# EAGLE design miniSpinac (EAGLE 6.4)
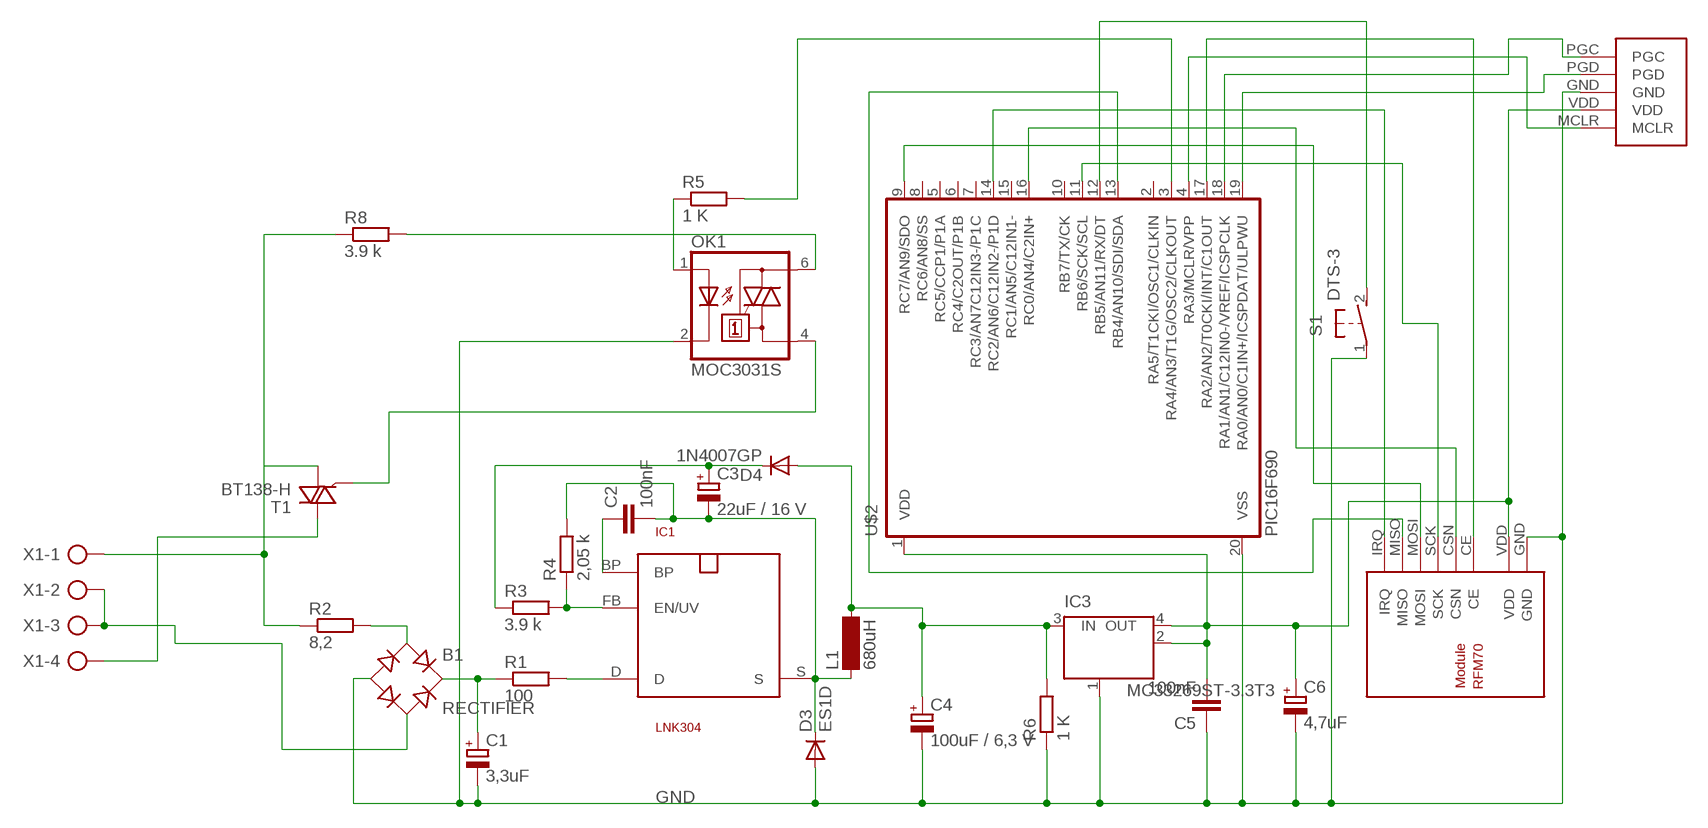
[diagram p0: schematic, sheet 1]

## Parts
B1  RECTIFIER  RECTIFIER-S40  [TO-269AA]
C1  3,3uF  CPOL-EUE5-10.5  [E5-10,5]
C2  100nF  C-EUC2012  [C2012]
C3  22uF / 16 V  CPOL-EUSMCC  [SMC_C]
C4  100uF / 6,3 V  CPOL-EUE2.5-5  [E2,5-5]
C5  100nF  C-EUC2012  [C2012]
C6  4,7uF  CPOL-EUSMCA  [SMC_A]
D3  ES1D  DIODE-DO214AC  [DO214AC]
D4  1N4007GP  DIODE-DO214AA  [DO214AA]
IC1  LNK304  SO-8C  [SO-8C]
IC3  MC33269ST-3.3T3  [SOT223]
L1  680uH  BS11  [BS11]
OK1  MOC3031S  [DIL6-SMD]
R1  100  R-EU_R2512W  [R2512W]
R2  8,2  R-EU_0411/12  [0411/12]
R3  3.9 k  R-EU_M2012  [M2012]
R4  2,05 k  R-EU_M2012  [M2012]
R5  1 K  R-EU_M2012  [M2012]
R6  1 K  R-EU_M2012  [M2012]
R8  3.9 k  R-EU_M2012  [M2012]
S1  DTS-3  [DTS-3]
T1  BT138-H  [TO220BH]
U$1  RFM70  [RFM70]
U$2  PIC16F690  [SSOP20]
U$3  PROGRAMMINGHEADERDIP  [PROGHEADER]
X1  AK500/4  [AK500/4]

## Nets
GND: B1.- C1.- C4.- C5.1 C6.- D3.A IC3.1(GND/ADJ) OK1.2(C) R6.1 S1.1 U$1.GND U$2.20(VSS) U$3.GND
N$1: IC1.D R1.2
N$2: B1.+ C1.+ R1.1
N$3: B1.AC1 R2.2
N$4: B1.AC2 X1.2 X1.3
N$5: S1.2 U$2.12(RB5/AN11/RX/DT)
N$6: T1.T2(A2) X1.4
N$7: OK1.1(A) R5.1
N$8: OK1.4(A1) T1.G
N$9: C3.+ D4.C R3.1
N$10: C2.1 IC1.BP
N$11: IC1.FB(EN/UV) R3.2 R4.1
N$12: U$1.MISO U$2.13(RB4/AN10/SDI/SDA)
N$13: C2.2 C3.- D3.C IC1.S L1.1 R4.2
N$14: OK1.6(A2) R8.2
N$16: U$1.CE U$2.17(RA2/AN2/T0CKI/INT/C1OUT)
N$18: U$2.19(RA0/AN0/C1IN+/ICSPDAT/ULPWU) U$3.PGD
N$19: U$2.18(RA1/AN1/C12IN0-/VREF/ICSPCLK) U$3.PGC
N$20: U$1.CSN U$2.16(RC0/AN4/C2IN+)
N$21: U$1.IRQ U$2.14(RC2/AN6/C12IN2-/P1D)
N$22: U$1.SCK U$2.11(RB6/SCK/SCL)
N$23: U$1.MOSI U$2.9(RC7/AN9/SDO)
N$25: U$2.4(RA3/MCLR/VPP) U$3.MCLR
N$26: C4.+ D4.A IC3.3(IN) L1.2 R6.2
N$28: C5.2 C6.+ IC3.2(OUT) IC3.4(OUT) U$1.VDD U$2.1(VDD) U$3.VDD
N$35: R5.2 U$2.3(RA4/AN3/T1G/OSC2/CLKOUT)
N$36: R2.1 R8.1 T1.T1(A1) X1.1
Unconnected: U$2.2(RA5/T1CKI/OSC1/CLKIN) U$2.5(RC5/CCP1/P1A) U$2.6(RC4/C2OUT/P1B) U$2.7(RC3/AN7C12IN3-/P1C) U$2.8(RC6/AN8/SS) U$2.10(RB7/TX/CK) U$2.15(RC1/AN5/C12IN1-)

## Library data of the parts
B1 = rectifier:RECTIFIER-: Rectifier
C1 C3 C4 C6 = resistor:CPOL-EU: POLARIZED CAPACITOR, European symbol
C2 C5 = resistor:C-EU: CAPACITOR, European symbol
D3 D4 = diode:DIODE-: DIODE
IC1 = powerint:SO-8C: 700V MOSFET für Schaltnetz-Trafos. Pin 3 fehlt. SMD
IC3 = linear:MC33269ST*: Adjustable Output Low Dropout Voltage Regulator 800 mA Source: http://www.onsemi.com/pub/Collateral/MC33269-D.PDF
L1 = inductor-neosid:BS: INDUCTOR nominal inductance, magnetically screened; OC_FARNELL: unknown; OC_NEWARK: unknown
OK1 = optocoupler:MOC30*: 6-Pin DIP Zero-Cross Optoisolators Triac Driver Output (250/400 Volt Peak) Source: http://www.fairchildsemi.com/ds/MO/MOC3043-M.pdf; MF: FAIRCHILD SEMICONDUCTOR; MPN: MOC3031SM; OC_FARNELL: unknown; OC_NEWARK: 34C1335
R1-R6 R8 = resistor:R-EU_: RESISTOR, European symbol
S1 = switch-tact:DTS-3
T1 = triac:BT138: TRIAC Source: http://www.semiconductors.philips.com BT138_SERIES_2.pdf
U$1 = rfm70:RFM70: RFM70 2.4 Ghz Funkmodul Autor: Daniel Weber Website: http://projects.web4clans.com Email: daniel.weber@web4clans.com
U$2 = microchip:PIC16F690*: MICROCONTROLLER PIC16F690 18 I/O One 16-bit timer Two 8-bit timer Two comparators Precision internal oscillator-software selectable 8 MHz - 32 KHz SSP w/ I2C Compatible Address mask option EUSART LIN 2.0 Compatible ECCP+ w/ PWM Steering 12 A/D Channels ULPW Enhanced Low Power Timer 1 Timer 1 Gate Synch Latch 4k Program Flash memory 256 bytes SRAM 256 bytes EEPROM
U$3 = rfm70:PROGRAMMINGHEADER
X1 = con-ptr500:AK500/4: CONNECTOR; OC_FARNELL: unknown; OC_NEWARK: unknown

## Board
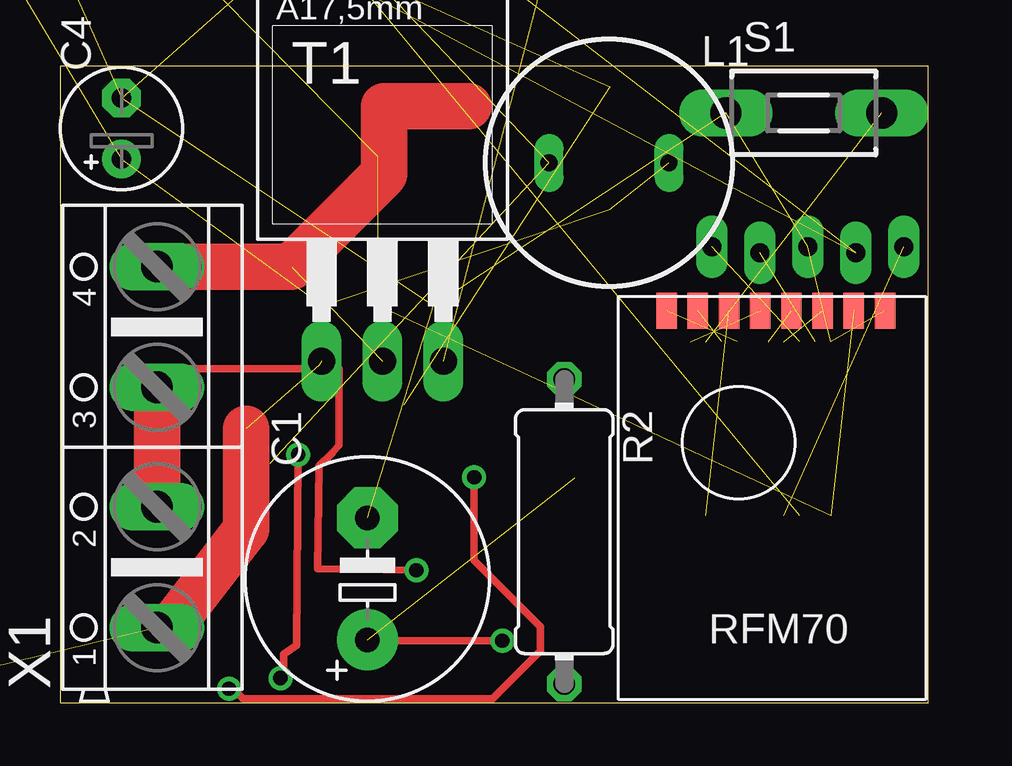
[diagram p1: board, top side]
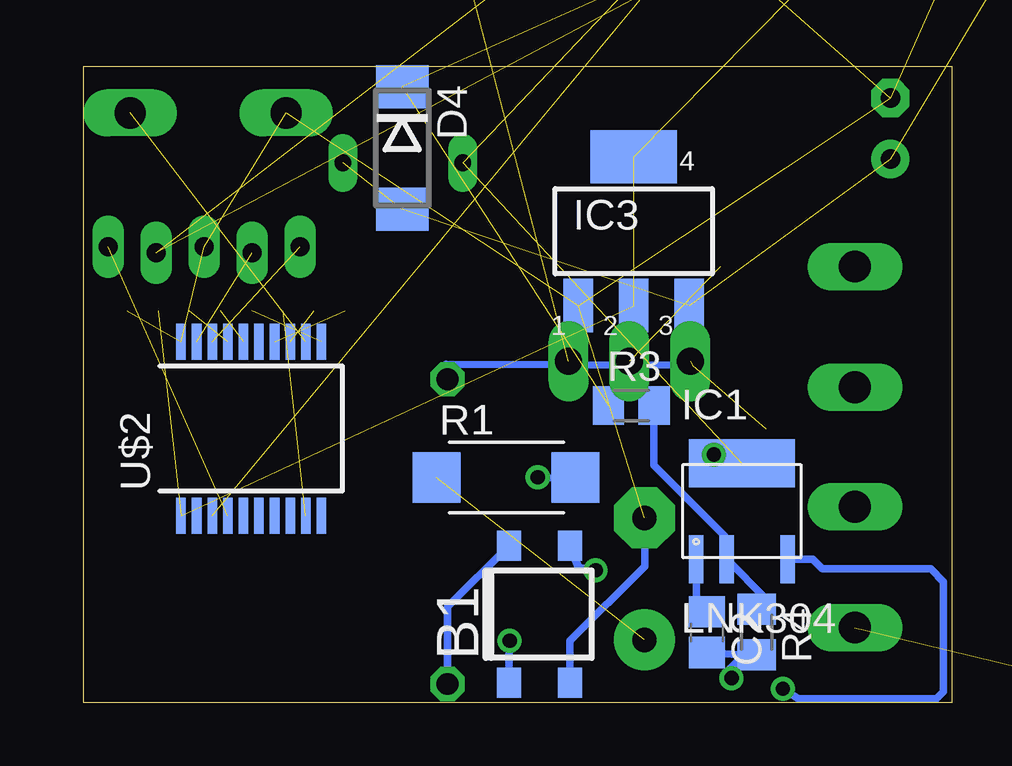
[diagram p2: board, bottom side, seen from below]

Size 36.2 x 26.51 mm. Coordinates in mm from the lower left corner, seen from the top.
Outline: 0,0 36.2,0 36.2,26.51 0,26.51 0,0
Copper layers (1*16): Top 0.035mm / dielectric 1.5mm / Bottom 0.035mm
Design rules "default": minimum track width 10mil, minimum drill 24mil, track to track 8mil, track to pad 8mil, pad to pad 8mil, via to via 8mil, smd to smd 8mil, copper to edge 40mil, drill to drill 8mil, minimum pad ring 10mil, minimum via ring 8mil, stop-mask expansion 4mil, vias tented up to drill 0mil, thermal gap 10mil

### Footprints (pad centres in the part's own frame; a part is rotated, then mirrored left to right if it is on the bottom)
TO-269AA = smd 1 x 1.25: + -1.28,-2.855; - 1.28,-2.855; AC1 -1.28,2.855; AC2 1.28,2.855
E5-10,5 = drill 1.016 pad 2.54: + -2.54,0 | drill 1.016 pad 2.54 octagon: - 2.54,0
C2012 = smd 1.3 x 1.5: 1 -0.85,0; 2 0.85,0
SMC_C = smd 2.4 x 2.4: + -2.5,0; - 2.5,0
E2,5-5 = drill 0.813 pad 1.6: + -1.27,0 | drill 0.813 pad 1.6 octagon: - 1.27,0
SMC_A = smd 1.6 x 1.4: + -1.5,0; - 1.5,0
DO214AC = smd 1.8 x 1.7: A 2.05,0; C -2.05,0
DO214AA = smd 1.8 x 2.2: A 2.55,0; C -2.55,0
SO-8C = smd 0.6 x 2: BP -1.905,-2; D 1.905,-2; FB -0.635,-2 | smd 4.41 x 2: S 0,2
SOT223 = smd 1.219 x 2.235: 1 -2.311,-3.099; 2 0,-3.099; 3 2.311,-3.099 | smd 3.6 x 2.2: 4 0,3.099
BS11 = drill 0.7 long: 1 -2.5,0; 2 2.5,0
DIL6-SMD = smd 1.78 x 1.52: 1 -2.54,-4.645; 2 0,-4.645; 3 2.54,-4.645; 4 2.54,4.645; 5 0,4.645; 6 -2.54,4.645
R2512W = smd 2 x 2.1: 1 -2.896,0; 2 2.896,0
0411/12 = drill 0.914 octagon: 1 -6.35,0; 2 6.35,0
M2012 = smd 1.3 x 1.6: 1 -0.95,0; 2 0.95,0
DTS-3 = drill 1.3 long: 1 -3.25,0; 2 3.25,0
TO220BH = drill 1.118 long: G 2.54,-6.35; T1 -2.54,-6.35; T2 0,-6.35 | hole 3.302: 0,11.176
RFM70 = smd 0.85 x 1.5: CE 2.5,-14.3; CSN 3.8,-14.3; GND -0.1,-14.3; IRQ 9,-14.3; MISO 7.7,-14.3; MOSI 6.4,-14.3; SCK 5.1,-14.3; VDD 1.2,-14.3
SSOP20 = smd 0.4 x 1.5: 1 -2.925,-3.625; 2 -2.275,-3.625; 3 -1.625,-3.625; 4 -0.975,-3.625; 5 -0.325,-3.625; 6 0.325,-3.625; 7 0.975,-3.625; 8 1.625,-3.625; 9 2.275,-3.625; 10 2.925,-3.625; 11 2.925,3.625; 12 2.275,3.625; 13 1.625,3.625; 14 0.975,3.625; 15 0.325,3.625; 16 -0.325,3.625; 17 -0.975,3.625; 18 -1.625,3.625; 19 -2.275,3.625; 20 -2.925,3.625
PROGHEADER = drill 0.8 long: GND 0,0; MCLR -4,0; PGC 4,0; PGD 2,0.25; VDD -2,0.25
AK500/4 = drill 1.321 long: 1 -7.518,0; 2 -2.489,0; 3 2.489,0; 4 7.518,0

### Placement (x,y rotation side)
B1  17.19,3.7 0 bottom
C1  12.82,5.16 90 top
C2  10.22,2.95 270 bottom
C3  -39.37,54.61 0 top  (outside the outline)
C4  2.57,23.93 90 top
C5  -49.53,62.23 0 top  (outside the outline)
C6  -31.75,69.85 0 top  (outside the outline)
D3  -16.51,63.5 0 top  (outside the outline)
D4  22.92,23.11 270 bottom
IC1  8.76,7.99 0 bottom
IC3  13.27,19.65 0 bottom
L1  22.89,22.5 0 top
OK1  23.57,48.4 0 top  (outside the outline)
R1  18.58,9.39 0 bottom
R2  21.02,7.13 270 top
R3  13.36,12.39 0 bottom
R4  8.14,2.95 270 bottom
R5  -21.59,69.85 0 top  (outside the outline)
R6  -26.67,69.85 0 top  (outside the outline)
R8  -49.53,-9.95 0 top  (outside the outline)
S1  31.01,24.58 0 top
T1  13.45,20.59 0 top
U$1  34.29,2.03 180 top
U$2  29.21,11.43 0 bottom
U$3  31.18,19.01 180 top
X1  4.05,10.66 90 top

### Tracks (layer width: path | path; a pad name or v marks a point on that pad's centre or on a via)
GND  (11 unrouted)
  Bottom 0.305: B1.- 15.91,2.59 12.8,5.7 12.8,7.69 C1.-
N$1  (via drill 0.6)
  Top 0.305: v7.05,0.59 7.05,0.76 7.63,0.18 18.03,0.18 20.03,2.17 20.03,3.17 17.27,5.93 v17.27,9.4
  Bottom 0.305: IC1.D 5.81,5.99 5.4,5.58 0.88,5.58 0.35,5.05 0.35,0.47 0.65,0.18 6.4,0.18 v7.05,0.59 | v17.27,9.4 15.73,9.34 R1.2
N$2  (via drill 0.6)  (1 unrouted)
  Top 0.305: v18.44,2.58 12.86,2.58 C1.+
  Bottom 0.305: B1.+ 18.47,2.55 v18.44,2.58
N$3
  Bottom 0.305: R2.2 21.02,4 B1.AC1
N$4  (via drill 0.6)
  Top 0.305: v14.86,5.52 10.75,5.58 10.81,9.87 11.34,10.4 11.63,10.75 11.63,13.93 4.83,13.93 X1.3
  Top 1.93: X1.2 X1.3
  Bottom 0.305: B1.AC2 15.56,5.64 v14.86,5.52
N$5  (1 unrouted)
N$6  (1 unrouted)
  Top 1.93: X1.4 9.65,18.18 13.51,22.03 13.51,24.85 17.04,24.85
N$7  (1 unrouted)
N$8  (1 unrouted)
N$9  (2 unrouted)
N$10
  Bottom 0.305: IC1.BP 10.66,4.12 C2.1
N$11
  Bottom 0.305: R4.1 7.73,4.32 IC1.FB 9.46,6.05 9.46,6.93 12.41,9.89 R3.2
N$12  (1 unrouted)
N$13  (via drill 0.6)  (3 unrouted)
  Top 0.305: v9.93,10.34 9.87,2.4 9.32,2.03 9.32,1.22 v9.19,1.03
  Bottom 0.305: C2.2 8.69,1.99 | 8.69,1.99 7.75,1.92 R4.2 | IC1.S 8.76,9.16 v9.93,10.34 | v9.19,1.03 9.28,1.39 8.69,1.99
N$14  (1 unrouted)
N$16  (1 unrouted)
N$18  (1 unrouted)
N$19  (1 unrouted)
N$20  (1 unrouted)
N$21  (1 unrouted)
N$22  (1 unrouted)
N$23  (1 unrouted)
N$25  (1 unrouted)
N$26  (4 unrouted)
N$28  (6 unrouted)
N$35  (1 unrouted)
N$36  (3 unrouted)
  Top 1.93: X1.1 4.6,3.14 7.75,7.23 7.75,11.43
  Bottom 0.305: R2.1 21.08,13.48 21.08,14.1 10.81,14.07